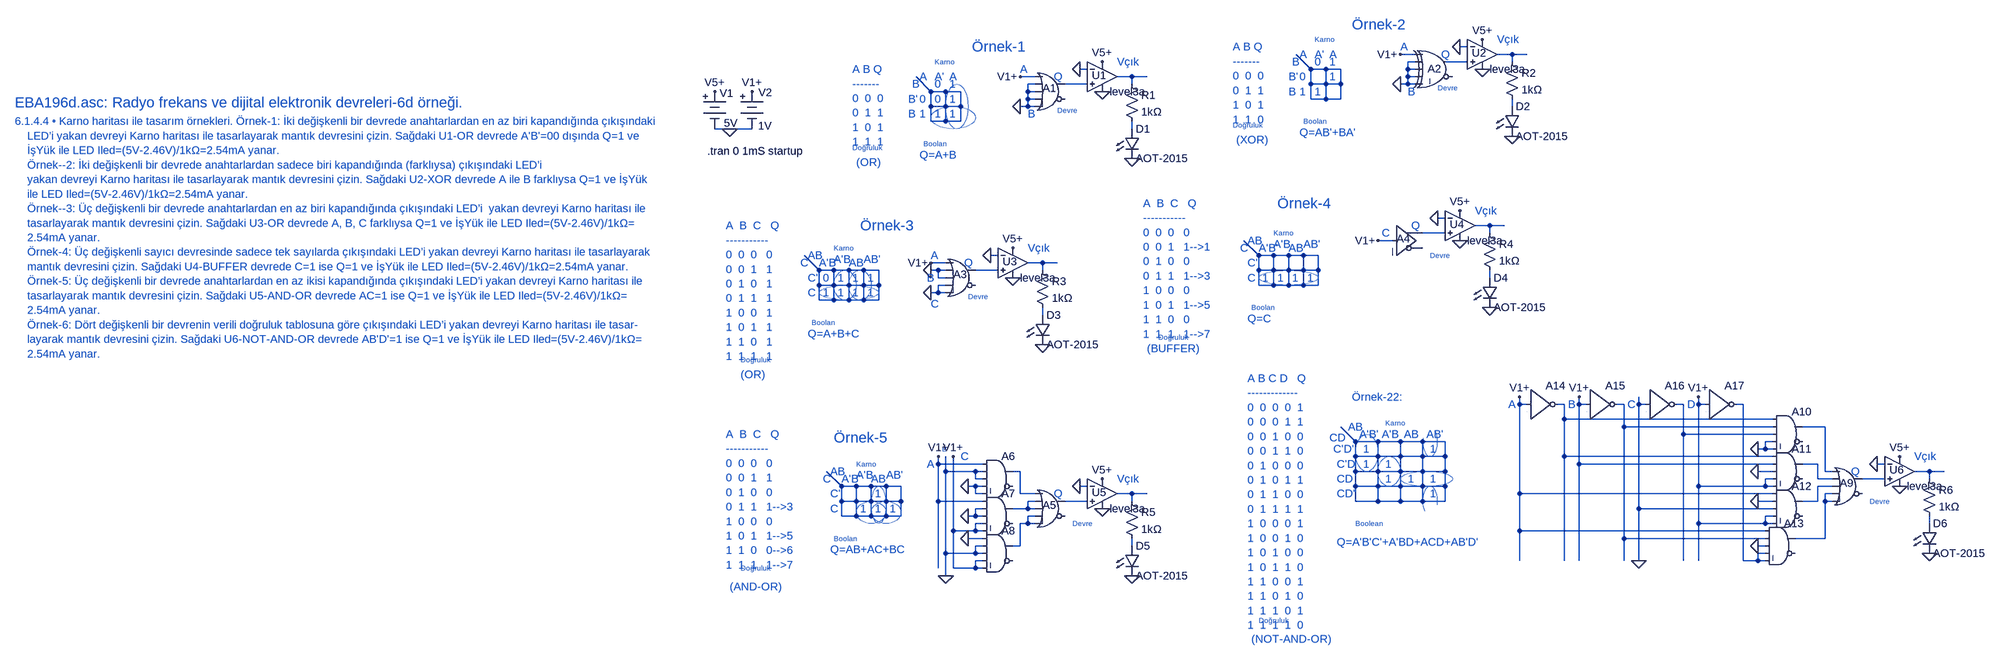
[diagram p0: schematic EBA196d.asc]
EBA196d.asc, the LTspice schematic file:
Version 4
SHEET 1 7064 4332
WIRE 3360 -64 3344 -64
WIRE 3248 -48 3216 -48
WIRE 3456 -48 3424 -48
WIRE 3488 -48 3456 -48
WIRE 3248 -32 3232 -32
WIRE 3360 -32 3312 -32
WIRE 3456 -32 3456 -48
WIRE 2544 -16 2528 -16
WIRE 3024 -16 2992 -48
WIRE 3056 -16 3024 -16
WIRE 3088 -16 3056 -16
WIRE 3232 -16 3232 -32
WIRE 3248 -16 3232 -16
WIRE 2432 0 2400 0
WIRE 2640 0 2608 0
WIRE 2672 0 2640 0
WIRE 3232 0 3232 -16
WIRE 3248 0 3232 0
WIRE 2432 16 2416 16
WIRE 2544 16 2496 16
WIRE 2640 16 2640 0
WIRE 3024 16 3024 -16
WIRE 3056 16 3056 -16
WIRE 3056 16 3024 16
WIRE 3088 16 3088 -16
WIRE 3088 16 3056 16
WIRE 3232 16 3232 0
WIRE 3232 16 3216 16
WIRE 3248 16 3232 16
WIRE 2208 32 2176 0
WIRE 2240 32 2208 32
WIRE 2272 32 2240 32
WIRE 2416 32 2416 16
WIRE 2432 32 2416 32
WIRE 2416 48 2416 32
WIRE 2432 48 2416 48
WIRE 3024 48 3024 16
WIRE 3056 48 3056 16
WIRE 3056 48 3024 48
WIRE 3088 48 3088 16
WIRE 3088 48 3056 48
WIRE 2208 64 2208 32
WIRE 2240 64 2240 32
WIRE 2240 64 2208 64
WIRE 2272 64 2272 32
WIRE 2272 64 2240 64
WIRE 2416 64 2416 48
WIRE 2416 64 2400 64
WIRE 2432 64 2416 64
WIRE 3456 64 3456 48
WIRE 2208 96 2208 64
WIRE 2240 96 2240 64
WIRE 2240 96 2208 96
WIRE 2272 96 2272 64
WIRE 2272 96 2240 96
WIRE 1776 112 1744 112
WIRE 1824 112 1776 112
WIRE 2640 112 2640 96
WIRE 3312 304 3296 304
WIRE 3408 320 3376 320
WIRE 3440 320 3408 320
WIRE 3312 336 3264 336
WIRE 3408 336 3408 320
WIRE 3200 352 3168 352
WIRE 2352 384 2336 384
WIRE 2912 384 2880 352
WIRE 2944 384 2912 384
WIRE 2976 384 2944 384
WIRE 3008 384 2976 384
WIRE 3040 384 3008 384
WIRE 2240 400 2208 400
WIRE 2448 400 2416 400
WIRE 2480 400 2448 400
WIRE 1968 416 1936 384
WIRE 2000 416 1968 416
WIRE 2032 416 2000 416
WIRE 2064 416 2032 416
WIRE 2096 416 2064 416
WIRE 2224 416 2208 416
WIRE 2240 416 2224 416
WIRE 2352 416 2304 416
WIRE 2448 416 2448 400
WIRE 2912 416 2912 384
WIRE 2944 416 2944 384
WIRE 2944 416 2912 416
WIRE 2976 416 2976 384
WIRE 2976 416 2944 416
WIRE 3008 416 3008 384
WIRE 3008 416 2976 416
WIRE 3040 416 3040 384
WIRE 3040 416 3008 416
WIRE 2224 432 2224 416
WIRE 2240 432 2224 432
WIRE 3408 432 3408 416
WIRE 1968 448 1968 416
WIRE 2000 448 2000 416
WIRE 2000 448 1968 448
WIRE 2032 448 2032 416
WIRE 2032 448 2000 448
WIRE 2064 448 2064 416
WIRE 2064 448 2032 448
WIRE 2096 448 2096 416
WIRE 2096 448 2064 448
WIRE 2240 448 2224 448
WIRE 2912 448 2912 416
WIRE 2944 448 2944 416
WIRE 2944 448 2912 448
WIRE 2976 448 2976 416
WIRE 2976 448 2944 448
WIRE 3008 448 3008 416
WIRE 3008 448 2976 448
WIRE 3040 448 3040 416
WIRE 3040 448 3008 448
WIRE 2224 464 2224 448
WIRE 2224 464 2208 464
WIRE 2240 464 2224 464
WIRE 1968 480 1968 448
WIRE 2000 480 2000 448
WIRE 2000 480 1968 480
WIRE 2032 480 2032 448
WIRE 2032 480 2000 480
WIRE 2064 480 2064 448
WIRE 2064 480 2032 480
WIRE 2096 480 2096 448
WIRE 2096 480 2064 480
WIRE 2448 512 2448 496
WIRE 3472 704 3472 688
WIRE 3488 704 3472 704
WIRE 3568 704 3552 704
WIRE 3600 704 3600 688
WIRE 3616 704 3600 704
WIRE 3696 704 3680 704
WIRE 3728 704 3728 688
WIRE 3744 704 3728 704
WIRE 3824 704 3808 704
WIRE 3856 704 3856 688
WIRE 3872 704 3856 704
WIRE 3952 704 3936 704
WIRE 3568 736 3568 704
WIRE 4016 736 3568 736
WIRE 3696 752 3696 704
WIRE 4016 752 3696 752
WIRE 4128 752 4080 752
WIRE 3824 768 3824 704
WIRE 4016 768 3824 768
WIRE 3120 784 3088 752
WIRE 3168 784 3120 784
WIRE 3216 784 3168 784
WIRE 3264 784 3216 784
WIRE 3312 784 3264 784
WIRE 4016 784 4000 784
WIRE 4000 800 4000 784
WIRE 4000 800 3984 800
WIRE 4016 800 4000 800
WIRE 3120 816 3120 784
WIRE 3168 816 3168 784
WIRE 3168 816 3120 816
WIRE 3216 816 3216 784
WIRE 3216 816 3168 816
WIRE 3264 816 3264 784
WIRE 3264 816 3216 816
WIRE 3312 816 3312 784
WIRE 3312 816 3264 816
WIRE 3568 816 3568 736
WIRE 4016 816 3568 816
WIRE 2224 832 2224 816
WIRE 2320 832 2224 832
WIRE 3600 832 3600 704
WIRE 4016 832 3600 832
WIRE 4112 832 4080 832
WIRE 4256 832 4240 832
WIRE 2240 848 2240 816
WIRE 2304 848 2240 848
WIRE 2320 848 2304 848
WIRE 2400 848 2384 848
WIRE 3120 848 3120 816
WIRE 3168 848 3168 816
WIRE 3168 848 3120 848
WIRE 3216 848 3216 816
WIRE 3216 848 3168 848
WIRE 3264 848 3264 816
WIRE 3264 848 3216 848
WIRE 3312 848 3312 816
WIRE 3312 848 3264 848
WIRE 4016 848 3984 848
WIRE 4128 848 4128 752
WIRE 4144 848 4128 848
WIRE 4352 848 4320 848
WIRE 4384 848 4352 848
WIRE 2304 864 2304 848
WIRE 2320 864 2304 864
WIRE 4016 864 4000 864
WIRE 4112 864 4112 832
WIRE 4144 864 4112 864
WIRE 4256 864 4208 864
WIRE 4352 864 4352 848
WIRE 2016 880 1984 848
WIRE 2048 880 2016 880
WIRE 2080 880 2048 880
WIRE 2112 880 2080 880
WIRE 2144 880 2112 880
WIRE 2304 880 2288 880
WIRE 2320 880 2304 880
WIRE 2544 880 2528 880
WIRE 3120 880 3120 848
WIRE 3168 880 3168 848
WIRE 3168 880 3120 880
WIRE 3216 880 3216 848
WIRE 3216 880 3168 880
WIRE 3264 880 3264 848
WIRE 3264 880 3216 880
WIRE 3312 880 3312 848
WIRE 3312 880 3264 880
WIRE 3856 880 3856 704
WIRE 4000 880 4000 864
WIRE 4000 880 3856 880
WIRE 4016 880 4000 880
WIRE 4144 880 4112 880
WIRE 2304 896 2304 880
WIRE 2320 896 2304 896
WIRE 2400 896 2400 848
WIRE 2432 896 2400 896
WIRE 2640 896 2608 896
WIRE 2672 896 2640 896
WIRE 3472 896 3472 704
WIRE 4016 896 3472 896
WIRE 4144 896 4128 896
WIRE 2016 912 2016 880
WIRE 2048 912 2048 880
WIRE 2048 912 2016 912
WIRE 2080 912 2080 880
WIRE 2080 912 2048 912
WIRE 2112 912 2112 880
WIRE 2112 912 2080 912
WIRE 2144 912 2144 880
WIRE 2144 912 2112 912
WIRE 2224 912 2224 832
WIRE 2320 912 2224 912
WIRE 2432 912 2416 912
WIRE 2544 912 2496 912
WIRE 2640 912 2640 896
WIRE 3120 912 3120 880
WIRE 3168 912 3168 880
WIRE 3168 912 3120 912
WIRE 3216 912 3216 880
WIRE 3216 912 3168 912
WIRE 3264 912 3264 880
WIRE 3264 912 3216 912
WIRE 3312 912 3312 880
WIRE 3312 912 3264 912
WIRE 4016 912 3984 912
WIRE 4112 912 4112 880
WIRE 4112 912 4080 912
WIRE 4128 912 4128 896
WIRE 4144 912 4128 912
WIRE 2320 928 2304 928
WIRE 2416 928 2416 912
WIRE 2416 928 2384 928
WIRE 2432 928 2416 928
WIRE 3728 928 3728 704
WIRE 4016 928 3728 928
WIRE 2016 944 2016 912
WIRE 2048 944 2048 912
WIRE 2048 944 2016 944
WIRE 2080 944 2080 912
WIRE 2080 944 2048 944
WIRE 2112 944 2112 912
WIRE 2112 944 2080 944
WIRE 2144 944 2144 912
WIRE 2144 944 2112 944
WIRE 2304 944 2304 928
WIRE 2304 944 2288 944
WIRE 2320 944 2304 944
WIRE 2432 944 2416 944
WIRE 4016 944 4000 944
WIRE 2320 960 2304 960
WIRE 2416 960 2416 944
WIRE 2416 960 2400 960
WIRE 2432 960 2416 960
WIRE 3856 960 3856 880
WIRE 4000 960 4000 944
WIRE 4000 960 3856 960
WIRE 4016 960 4000 960
WIRE 4352 960 4352 944
WIRE 2256 976 2256 816
WIRE 2304 976 2304 960
WIRE 2304 976 2256 976
WIRE 2320 976 2304 976
WIRE 3472 976 3472 896
WIRE 4000 976 3472 976
WIRE 2320 992 2288 992
WIRE 3696 992 3696 752
WIRE 4000 992 3696 992
WIRE 4128 992 4128 912
WIRE 4128 992 4064 992
WIRE 2320 1008 2304 1008
WIRE 2400 1008 2400 960
WIRE 2400 1008 2384 1008
WIRE 2640 1008 2640 992
WIRE 4000 1008 3984 1008
WIRE 2240 1024 2240 848
WIRE 2304 1024 2304 1008
WIRE 2304 1024 2240 1024
WIRE 2320 1024 2304 1024
WIRE 4000 1024 3984 1024
WIRE 2320 1040 2304 1040
WIRE 3472 1040 3472 976
WIRE 3568 1040 3568 816
WIRE 3600 1040 3600 832
WIRE 3696 1040 3696 992
WIRE 3728 1040 3728 928
WIRE 3824 1040 3824 768
WIRE 3856 1040 3856 960
WIRE 3952 1040 3952 704
WIRE 3984 1040 3984 1024
WIRE 3984 1040 3952 1040
WIRE 4000 1040 3984 1040
WIRE 2224 1056 2224 912
WIRE 2256 1056 2256 976
WIRE 2304 1056 2304 1040
WIRE 2304 1056 2256 1056
WIRE 2320 1056 2304 1056
WIRE 2240 1072 2240 1024
FLAG 1776 112 0
FLAG 1744 32 V5+
FLAG 1824 32 V1+
FLAG 2528 -16 0
FLAG 2576 -32 V5+
FLAG 2576 32 0
FLAG 2400 0 V1+
FLAG 2400 64 0
FLAG 2640 176 0
FLAG 3344 -64 0
FLAG 3392 -80 V5+
FLAG 3392 -16 0
FLAG 3216 -48 V1+
FLAG 3216 16 0
FLAG 3456 128 0
FLAG 2336 384 0
FLAG 2384 368 V5+
FLAG 2384 432 0
FLAG 2208 400 V1+
FLAG 2208 464 0
FLAG 2448 576 0
FLAG 2208 416 0
FLAG 3296 304 0
FLAG 3344 288 V5+
FLAG 3344 352 0
FLAG 3168 352 V1+
FLAG 3408 496 0
FLAG 2528 880 0
FLAG 2576 864 V5+
FLAG 2576 928 0
FLAG 2224 816 V1+
FLAG 2640 1072 0
FLAG 2288 880 0
FLAG 2288 944 0
FLAG 2288 992 0
FLAG 2256 816 V1+
FLAG 2240 1072 0
FLAG 4240 832 0
FLAG 4288 816 V5+
FLAG 4288 880 0
FLAG 3472 688 V1+
FLAG 4352 1024 0
FLAG 3856 688 V1+
FLAG 3600 688 V1+
FLAG 3984 1008 0
FLAG 3984 848 0
FLAG 3984 800 0
FLAG 3984 912 0
FLAG 3728 1040 0
SYMBOL Misc\\battery 1744 16 R0
WINDOW 0 11 20 Left 2
WINDOW 3 20 84 Left 2
SYMATTR InstName V1
SYMATTR Value 5V
SYMBOL Misc\\battery 1824 16 R0
WINDOW 0 14 18 Left 2
WINDOW 3 13 90 Left 2
SYMATTR InstName V2
SYMATTR Value 1V
SYMBOL OpAmps\\UniversalOpAmp3 2576 0 R0
WINDOW 0 -22 -3 Left 2
SYMATTR InstName U1
SYMBOL Digital\\or 2464 -32 R0
WINDOW 0 -16 57 Left 2
SYMATTR InstName A1
SYMBOL LED 2624 112 R0
SYMATTR InstName D1
SYMATTR Value AOT-2015
SYMATTR Description Diode
SYMATTR Type diode
SYMBOL res 2624 0 R0
SYMATTR InstName R1
SYMATTR Value 1kΩ
SYMBOL OpAmps\\UniversalOpAmp3 3392 -48 R0
WINDOW 0 -22 -3 Left 2
SYMATTR InstName U2
SYMBOL LED 3440 64 R0
SYMATTR InstName D2
SYMATTR Value AOT-2015
SYMATTR Description Diode
SYMATTR Type diode
SYMBOL res 3440 -48 R0
SYMATTR InstName R2
SYMATTR Value 1kΩ
SYMBOL Digital\\xor 3296 -80 R0
WINDOW 0 -21 63 Left 2
SYMATTR InstName A2
SYMBOL OpAmps\\UniversalOpAmp3 2384 400 R0
WINDOW 0 -22 -3 Left 2
SYMATTR InstName U3
SYMBOL Digital\\or 2272 368 R0
WINDOW 0 -16 57 Left 2
SYMATTR InstName A3
SYMBOL LED 2432 512 R0
SYMATTR InstName D3
SYMATTR Value AOT-2015
SYMATTR Description Diode
SYMATTR Type diode
SYMBOL res 2432 400 R0
SYMATTR InstName R3
SYMATTR Value 1kΩ
SYMBOL OpAmps\\UniversalOpAmp3 3344 320 R0
WINDOW 0 -22 -3 Left 2
SYMATTR InstName U4
SYMBOL LED 3392 432 R0
SYMATTR InstName D4
SYMATTR Value AOT-2015
SYMATTR Description Diode
SYMATTR Type diode
SYMBOL res 3392 320 R0
SYMATTR InstName R4
SYMATTR Value 1kΩ
SYMBOL OpAmps\\UniversalOpAmp3 2576 896 R0
WINDOW 0 -22 -3 Left 2
SYMATTR InstName U5
SYMBOL Digital\\or 2464 864 R0
WINDOW 0 -16 57 Left 2
SYMATTR InstName A5
SYMBOL LED 2624 1008 R0
SYMATTR InstName D5
SYMATTR Value AOT-2015
SYMATTR Description Diode
SYMATTR Type diode
SYMBOL res 2624 896 R0
SYMATTR InstName R5
SYMATTR Value 1kΩ
SYMBOL Digital\\buf 3200 288 R0
WINDOW 0 8 60 Left 2
SYMATTR InstName A4
SYMBOL Digital\\and 2352 800 R0
SYMATTR InstName A6
SYMBOL Digital\\and 2352 880 R0
SYMATTR InstName A7
SYMBOL Digital\\and 2352 960 R0
SYMATTR InstName A8
SYMBOL OpAmps\\UniversalOpAmp3 4288 848 R0
WINDOW 0 -22 -3 Left 2
SYMATTR InstName U6
SYMBOL Digital\\or 4176 816 R0
WINDOW 0 -16 57 Left 2
SYMATTR InstName A9
SYMBOL LED 4336 960 R0
SYMATTR InstName D6
SYMATTR Value AOT-2015
SYMATTR Description Diode
SYMATTR Type diode
SYMBOL res 4336 848 R0
SYMATTR InstName R6
SYMATTR Value 1kΩ
SYMBOL Digital\\and 4048 704 R0
SYMATTR InstName A10
SYMBOL Digital\\and 4048 784 R0
SYMATTR InstName A11
SYMBOL Digital\\and 4048 864 R0
SYMATTR InstName A12
SYMBOL Digital\\and 4032 944 R0
SYMATTR InstName A13
SYMBOL Digital\\inv 3488 640 R0
SYMATTR InstName A14
SYMBOL Digital\\inv 3616 640 R0
SYMATTR InstName A15
SYMBOL Digital\\inv 3744 640 R0
SYMATTR InstName A16
SYMBOL Digital\\inv 3872 640 R0
SYMATTR InstName A17
TEXT -232 56 Left 3 ;EBA196d.asc: Radyo frekans ve dijital elektronik devreleri-6d örneği.
TEXT -232 96 Left 2 ;6.1.4.4 • Karno haritası ile tasarım örnekleri. Örnek-1: İki değişkenli bir devrede anahtarlardan en az biri kapandığında çıkışındaki \n    LED’i yakan devreyi Karno haritası ile tasarlayarak mantık devresini çizin. Sağdaki U1-OR devrede A'B'=00 dışında Q=1 ve \n    İşYük ile LED Iled=(5V-2.46V)/1kΩ=2.54mA yanar.\n    Örnek--2: İki değişkenli bir devrede anahtarlardan sadece biri kapandığında (farklıysa) çıkışındaki LED’i\n    yakan devreyi Karno haritası ile tasarlayarak mantık devresini çizin. Sağdaki U2-XOR devrede A ile B farklıysa Q=1 ve İşYük\n    ile LED Iled=(5V-2.46V)/1kΩ=2.54mA yanar.\n    Örnek--3: Üç değişkenli bir devrede anahtarlardan en az biri kapandığında çıkışındaki LED’i  yakan devreyi Karno haritası ile \n    tasarlayarak mantık devresini çizin. Sağdaki U3-OR devrede A, B, C farklıysa Q=1 ve İşYük ile LED Iled=(5V-2.46V)/1kΩ=\n    2.54mA yanar.\n    Örnek-4: Üç değişkenli sayıcı devresinde sadece tek sayılarda çıkışındaki LED’i yakan devreyi Karno haritası ile tasarlayarak \n    mantık devresini çizin. Sağdaki U4-BUFFER devrede C=1 ise Q=1 ve İşYük ile LED Iled=(5V-2.46V)/1kΩ=2.54mA yanar.\n    Örnek-5: Üç değişkenli bir devrede anahtarlardan en az ikisi kapandığında çıkışındaki LED’i yakan devreyi Karno haritası ile\n    tasarlayarak mantık devresini çizin. Sağdaki U5-AND-OR devrede AC=1 ise Q=1 ve İşYük ile LED Iled=(5V-2.46V)/1kΩ=\n    2.54mA yanar.\n    Örnek-6: Dört değişkenli bir devrenin verili doğruluk tablosuna göre çıkışındaki LED’i yakan devreyi Karno haritası ile tasar-\n    layarak mantık devresini çizin. Sağdaki U6-NOT-AND-OR devrede AB'D'=1 ise Q=1 ve İşYük ile LED Iled=(5V-2.46V)/1kΩ=\n    2.54mA yanar.
TEXT 1728 160 Left 2 !.tran 0 1mS startup
TEXT 2040 -16 Left 2 ;A B Q\n-------\n0  0  0\n0  1  1\n1  0  1\n1  1  1
TEXT 2184 48 Left 2 ;0
TEXT 2184 80 Left 2 ;1
TEXT 2216 16 Left 2 ;0
TEXT 2248 16 Left 2 ;1
TEXT 2168 16 Left 2 ;B
TEXT 2216 48 Left 2 ;0
TEXT 2216 80 Left 2 ;1
TEXT 2248 48 Left 2 ;1
TEXT 2248 80 Left 2 ;1
TEXT 2184 0 Left 2 ;A
TEXT 2184 168 Left 2 ;Q=A+B
TEXT 2608 -32 Left 2 ;Vçık
TEXT 2040 152 Left 1 ;Doğruluk
TEXT 2216 -32 Left 1 ;Karno
TEXT 2192 144 Left 1 ;Boolan
TEXT 2216 0 Left 2 ;A'
TEXT 2248 0 Left 2 ;A
TEXT 2160 48 Left 2 ;B'
TEXT 2160 80 Left 2 ;B
TEXT 2048 184 Left 2 ;(OR)
TEXT 2400 -16 Left 2 ;A
TEXT 2416 80 Left 2 ;B
TEXT 2480 72 Left 1 ;Devre
TEXT 2472 0 Left 2 ;Q
TEXT 2296 -64 Left 3 ;Örnek-1
TEXT 2856 -64 Left 2 ;A B Q\n-------\n0  0  0\n0  1  1\n1  0  1\n1  1  0
TEXT 3000 0 Left 2 ;0
TEXT 3000 32 Left 2 ;1
TEXT 3032 -32 Left 2 ;0
TEXT 3064 -32 Left 2 ;1
TEXT 2984 -32 Left 2 ;B
TEXT 3032 32 Left 2 ;1
TEXT 3064 0 Left 2 ;1
TEXT 3000 -48 Left 2 ;A
TEXT 3000 120 Left 2 ;Q=AB'+BA'
TEXT 3424 -80 Left 2 ;Vçık
TEXT 2856 104 Left 1 ;Doğruluk
TEXT 3032 -80 Left 1 ;Karno
TEXT 3008 96 Left 1 ;Boolan
TEXT 3032 -48 Left 2 ;A'
TEXT 3064 -48 Left 2 ;A
TEXT 2976 0 Left 2 ;B'
TEXT 2976 32 Left 2 ;B
TEXT 2864 136 Left 2 ;(XOR)
TEXT 3216 -64 Left 2 ;A
TEXT 3232 32 Left 2 ;B
TEXT 3296 24 Left 1 ;Devre
TEXT 3304 -48 Left 2 ;Q
TEXT 3112 -112 Left 3 ;Örnek-2
TEXT 1768 320 Left 2 ;A  B  C   Q\n-----------\n0  0  0   0\n0  0  1   1\n0  1  0   1\n0  1  1   1\n1  0  0   1\n1  0  1   1\n1  1  0   1\n1  1  1   1
TEXT 1944 432 Left 2 ;C'
TEXT 1944 464 Left 2 ;C
TEXT 1968 400 Left 2 ;A'B'
TEXT 2000 392 Left 2 ;A'B
TEXT 1928 400 Left 2 ;C
TEXT 1976 432 Left 2 ;0
TEXT 1976 464 Left 2 ;1
TEXT 2008 432 Left 2 ;1
TEXT 2008 464 Left 2 ;1
TEXT 1944 384 Left 2 ;AB
TEXT 1944 552 Left 2 ;Q=A+B+C
TEXT 2416 368 Left 2 ;Vçık
TEXT 1800 608 Left 1 ;Doğruluk
TEXT 2000 368 Left 1 ;Karno
TEXT 1952 528 Left 1 ;Boolan
TEXT 1800 640 Left 2 ;(OR)
TEXT 2208 384 Left 2 ;A
TEXT 2200 432 Left 2 ;B
TEXT 2288 472 Left 1 ;Devre
TEXT 2280 400 Left 2 ;Q
TEXT 2056 320 Left 3 ;Örnek-3
TEXT 2032 400 Left 2 ;AB
TEXT 2064 392 Left 2 ;AB'
TEXT 2040 432 Left 2 ;1
TEXT 2040 464 Left 2 ;1
TEXT 2072 432 Left 2 ;1
TEXT 2072 464 Left 2 ;1
TEXT 2208 488 Left 2 ;C
TEXT 2664 272 Left 2 ;A  B  C   Q\n-----------\n0  0  0   0\n0  0  1   1-->1\n0  1  0   0\n0  1  1   1-->3\n1  0  0   0\n1  0  1   1-->5\n1  1  0   0\n1  1  1   1-->7
TEXT 2888 400 Left 2 ;C'
TEXT 2888 432 Left 2 ;C
TEXT 2912 368 Left 2 ;A'B'
TEXT 2944 360 Left 2 ;A'B
TEXT 2872 368 Left 2 ;C
TEXT 2920 432 Left 2 ;1
TEXT 2952 432 Left 2 ;1
TEXT 2888 352 Left 2 ;AB
TEXT 2888 520 Left 2 ;Q=C
TEXT 3376 288 Left 2 ;Vçık
TEXT 2696 560 Left 1 ;Doğruluk
TEXT 2944 336 Left 1 ;Karno
TEXT 2896 496 Left 1 ;Boolan
TEXT 2672 584 Left 2 ;(BUFFER)
TEXT 3280 384 Left 1 ;Devre
TEXT 3240 320 Left 2 ;Q
TEXT 2952 272 Left 3 ;Örnek-4
TEXT 2976 368 Left 2 ;AB
TEXT 3008 360 Left 2 ;AB'
TEXT 2984 432 Left 2 ;1
TEXT 3016 432 Left 2 ;1
TEXT 3176 336 Left 2 ;C
TEXT 1768 768 Left 2 ;A  B  C   Q\n-----------\n0  0  0   0\n0  0  1   1\n0  1  0   0\n0  1  1   1-->3\n1  0  0   0\n1  0  1   1-->5\n1  1  0   0-->6\n1  1  1   1-->7
TEXT 1992 896 Left 2 ;C'
TEXT 1992 928 Left 2 ;C
TEXT 2016 864 Left 2 ;A'B'
TEXT 2048 856 Left 2 ;A'B
TEXT 1976 864 Left 2 ;C
TEXT 2056 928 Left 2 ;1
TEXT 1992 848 Left 2 ;AB
TEXT 1992 1016 Left 2 ;Q=AB+AC+BC
TEXT 2608 864 Left 2 ;Vçık
TEXT 1800 1056 Left 1 ;Doğruluk
TEXT 2048 832 Left 1 ;Karno
TEXT 2000 992 Left 1 ;Boolan
TEXT 1776 1096 Left 2 ;(AND-OR)
TEXT 2512 960 Left 1 ;Devre
TEXT 2472 896 Left 2 ;Q
TEXT 2000 776 Left 3 ;Örnek-5
TEXT 2080 864 Left 2 ;AB
TEXT 2112 856 Left 2 ;AB'
TEXT 2088 928 Left 2 ;1
TEXT 2120 928 Left 2 ;1
TEXT 2088 896 Left 2 ;1
TEXT 2200 832 Left 2 ;A
TEXT 2232 800 Left 1 ;B
TEXT 2272 816 Left 2 ;C
TEXT 2888 648 Left 2 ;A B C D   Q\n-------------\n0  0  0  0  1\n0  0  0  1  1\n0  0  1  0  0\n0  0  1  1  0\n0  1  0  0  0\n0  1  0  1  1\n0  1  1  0  0\n0  1  1  1  1\n1  0  0  0  1\n1  0  0  1  0\n1  0  1  0  0\n1  0  1  1  0\n1  1  0  0  1\n1  1  0  1  0\n1  1  1  0  1\n1  1  1  1  0
TEXT 2912 1168 Left 1 ;Doğruluk
TEXT 3072 800 Left 2 ;C'D'
TEXT 3080 832 Left 2 ;C'D
TEXT 3128 768 Left 2 ;A'B'
TEXT 3176 768 Left 2 ;A'B
TEXT 3104 752 Left 2 ;AB
TEXT 3064 776 Left 2 ;CD
TEXT 3136 832 Left 2 ;1
TEXT 3224 768 Left 2 ;AB
TEXT 3272 768 Left 2 ;AB'
TEXT 3080 864 Left 2 ;CD
TEXT 3080 896 Left 2 ;CD'
TEXT 3280 864 Left 2 ;1
TEXT 3184 744 Left 1 ;Karno
TEXT 3080 1000 Left 2 ;Q=A'B'C'+A'BD+ACD+AB'D'
TEXT 3120 960 Left 1 ;Boolean
TEXT 3184 832 Left 2 ;1
TEXT 3184 864 Left 2 ;1
TEXT 3112 688 Left 2 ;Örnek-22:
TEXT 3136 800 Left 2 ;1
TEXT 3280 896 Left 2 ;1
TEXT 3280 800 Left 2 ;1
TEXT 3232 864 Left 2 ;1
TEXT 4320 816 Left 2 ;Vçık
TEXT 4224 912 Left 1 ;Devre
TEXT 4184 848 Left 2 ;Q
TEXT 3448 704 Left 2 ;A
TEXT 3576 704 Left 2 ;B
TEXT 3704 704 Left 2 ;C
TEXT 3832 704 Left 2 ;D
TEXT 2896 1208 Left 2 ;(NOT-AND-OR)
CIRCLE Normal 2288 112 2240 16 2
CIRCLE Normal 2208 112 2304 64 2
CIRCLE Normal 2000 416 2000 416 2
CIRCLE Normal 2000 416 2000 416 2
CIRCLE Normal 2032 416 2080 480 2
CIRCLE Normal 2000 416 2048 480 2
CIRCLE Normal 1968 448 1968 448 2
CIRCLE Normal 2096 480 1968 448 2
CIRCLE Normal 2944 384 2944 384 2
CIRCLE Normal 2944 384 2944 384 2
CIRCLE Normal 2912 416 2912 416 2
CIRCLE Normal 3040 448 2912 416 2
CIRCLE Normal 2048 880 2048 880 2
CIRCLE Normal 2048 880 2048 880 2
CIRCLE Normal 2016 912 2016 912 2
CIRCLE Normal 2112 960 2080 880 2
CIRCLE Normal 2112 960 2048 912 2
CIRCLE Normal 2144 960 2080 912 2
CIRCLE Normal 3168 848 3120 768 2
CIRCLE Normal 3216 880 3168 816 2
CIRCLE Normal 3328 880 3216 848 2
ARC Normal 3264 816 3296 752 3235 762 3297 755 2
ARC Normal 3296 880 3264 944 3325 934 3263 941 2

The netlist it stands for:
* EBA196d.asc
V1 V5+ 0 5V
V2 V1+ 0 1V
XU1 N005 0 V5+ 0 N004 level3a  ; pins In+ In- V+ V- OUT
A1 V1+ 0 0 0 0 0 N005 0 OR
D1 N008 0 AOT-2015
R1 N004 N008 1kΩ
XU2 N002 0 V5+ 0 N001 level3a  ; pins In+ In- V+ V- OUT
D2 N007 0 AOT-2015
R2 N001 N007 1kΩ
A2 V1+ 0 0 0 0 0 N002 0 XOR
XU3 N014 0 V5+ 0 N012 level3a  ; pins In+ In- V+ V- OUT
A3 V1+ 0 0 0 0 0 N014 0 OR
D3 N016 0 AOT-2015
R3 N012 N016 1kΩ
XU4 N010 0 V5+ 0 N009 level3a  ; pins In+ In- V+ V- OUT
D4 N015 0 AOT-2015
R4 N009 N015 1kΩ
XU5 N032 0 V5+ 0 N029 level3a  ; pins In+ In- V+ V- OUT
A5 N024 N031 N031 N033 N033 0 N032 0 OR
D5 N035 0 AOT-2015
R5 N029 N035 1kΩ
A4 V1+ 0 0 0 0 0 N010 0 BUF
A6 V1+ 0 0 0 0 0 N024 0 AND
A7 V1+ 0 0 V1+ V1+ 0 N031 0 AND
A8 0 0 0 V1+ V1+ 0 N033 0 AND
XU6 N026 0 V5+ 0 N025 level3a  ; pins In+ In- V+ V- OUT
A9 N021 N023 N028 N030 N030 0 N026 0 OR
D6 N034 0 AOT-2015
R6 N025 N034 1kΩ
A10 N017 N018 N019 0 0 0 N021 0 AND
A11 N017 V1+ 0 V1+ V1+ 0 N023 0 AND
A12 V1+ 0 0 V1+ V1+ 0 N028 0 AND
A13 V1+ N018 0 N020 N020 0 N030 0 AND
A14 V1+ 0 0 0 0 N017 0 0 BUF
A15 V1+ 0 0 0 0 N018 0 0 BUF
A16 0 0 0 0 0 N019 0 0 BUF
A17 V1+ 0 0 0 0 N020 0 0 BUF
.model D D
.lib standard.dio
* EBA196d.asc: Radyo frekans ve dijital elektronik devreleri-6d örneği.
* 6.1.4.4 • Karno haritası ile tasarım örnekleri. Örnek-1: İki değişkenli bir devrede anahtarlardan en az biri kapandığında çıkışındaki
*     LED’i yakan devreyi Karno haritası ile tasarlayarak mantık devresini çizin. Sağdaki U1-OR devrede A'B'=00 dışında Q=1 ve
*     İşYük ile LED Iled=(5V-2.46V)/1kΩ=2.54mA yanar.
*     Örnek--2: İki değişkenli bir devrede anahtarlardan sadece biri kapandığında (farklıysa) çıkışındaki LED’i
*     yakan devreyi Karno haritası ile tasarlayarak mantık devresini çizin. Sağdaki U2-XOR devrede A ile B farklıysa Q=1 ve İşYük
*     ile LED Iled=(5V-2.46V)/1kΩ=2.54mA yanar.
*     Örnek--3: Üç değişkenli bir devrede anahtarlardan en az biri kapandığında çıkışındaki LED’i  yakan devreyi Karno haritası ile
*     tasarlayarak mantık devresini çizin. Sağdaki U3-OR devrede A, B, C farklıysa Q=1 ve İşYük ile LED Iled=(5V-2.46V)/1kΩ=
*     2.54mA yanar.
*     Örnek-4: Üç değişkenli sayıcı devresinde sadece tek sayılarda çıkışındaki LED’i yakan devreyi Karno haritası ile tasarlayarak
*     mantık devresini çizin. Sağdaki U4-BUFFER devrede C=1 ise Q=1 ve İşYük ile LED Iled=(5V-2.46V)/1kΩ=2.54mA yanar.
*     Örnek-5: Üç değişkenli bir devrede anahtarlardan en az ikisi kapandığında çıkışındaki LED’i yakan devreyi Karno haritası ile
*     tasarlayarak mantık devresini çizin. Sağdaki U5-AND-OR devrede AC=1 ise Q=1 ve İşYük ile LED Iled=(5V-2.46V)/1kΩ=
*     2.54mA yanar.
*     Örnek-6: Dört değişkenli bir devrenin verili doğruluk tablosuna göre çıkışındaki LED’i yakan devreyi Karno haritası ile tasar-
*     layarak mantık devresini çizin. Sağdaki U6-NOT-AND-OR devrede AB'D'=1 ise Q=1 ve İşYük ile LED Iled=(5V-2.46V)/1kΩ=
*     2.54mA yanar.
.tran 0 1mS startup
* A B Q
* -------
* 0  0  0
* 0  1  1
* 1  0  1
* 1  1  1
* 0
* 1
* 0
* 1
* B
* 0
* 1
* 1
* 1
* A
* Q=A+B
* Vçık
* Doğruluk
* Karno
* Boolan
* A'
* A
* B'
* B
* (OR)
* A
* B
* Devre
* Q
* Örnek-1
* A B Q
* -------
* 0  0  0
* 0  1  1
* 1  0  1
* 1  1  0
* 0
* 1
* 0
* 1
* B
* 1
* 1
* A
* Q=AB'+BA'
* Vçık
* Doğruluk
* Karno
* Boolan
* A'
* A
* B'
* B
* (XOR)
* A
* B
* Devre
* Q
* Örnek-2
* A  B  C   Q
* -----------
* 0  0  0   0
* 0  0  1   1
* 0  1  0   1
* 0  1  1   1
* 1  0  0   1
* 1  0  1   1
* 1  1  0   1
* 1  1  1   1
* C'
* C
* A'B'
* A'B
* C
* 0
* 1
* 1
* 1
* AB
* Q=A+B+C
* Vçık
* Doğruluk
* Karno
* Boolan
* (OR)
* A
* B
* Devre
* Q
* Örnek-3
* AB
* AB'
* 1
* 1
* 1
* 1
* C
* A  B  C   Q
* -----------
* 0  0  0   0
* 0  0  1   1-->1
* 0  1  0   0
* 0  1  1   1-->3
* 1  0  0   0
* 1  0  1   1-->5
* 1  1  0   0
* 1  1  1   1-->7
* C'
* C
* A'B'
* A'B
* C
* 1
* 1
* AB
* Q=C
* Vçık
* Doğruluk
* Karno
* Boolan
* (BUFFER)
* Devre
* Q
* Örnek-4
* AB
* AB'
* 1
* 1
* C
* A  B  C   Q
* -----------
* 0  0  0   0
* 0  0  1   1
* 0  1  0   0
* 0  1  1   1-->3
* 1  0  0   0
* 1  0  1   1-->5
* 1  1  0   0-->6
* 1  1  1   1-->7
* C'
* C
* A'B'
* A'B
* C
* 1
* AB
* Q=AB+AC+BC
* Vçık
* Doğruluk
* Karno
* Boolan
* (AND-OR)
* Devre
* Q
* Örnek-5
* AB
* AB'
* 1
* 1
* 1
* A
* B
* C
* A B C D   Q
* -------------
* 0  0  0  0  1
* 0  0  0  1  1
* 0  0  1  0  0
* 0  0  1  1  0
* 0  1  0  0  0
* 0  1  0  1  1
* 0  1  1  0  0
* 0  1  1  1  1
* 1  0  0  0  1
* 1  0  0  1  0
* 1  0  1  0  0
* 1  0  1  1  0
* 1  1  0  0  1
* 1  1  0  1  0
* 1  1  1  0  1
* 1  1  1  1  0
* Doğruluk
* C'D'
* C'D
* A'B'
* A'B
* AB
* CD
* 1
* AB
* AB'
* CD
* CD'
* 1
* Karno
* Q=A'B'C'+A'BD+ACD+AB'D'
* Boolean
* 1
* 1
* Örnek-22:
* 1
* 1
* 1
* 1
* Vçık
* Devre
* Q
* A
* B
* C
* D
* (NOT-AND-OR)
.backanno
.end